# EAGLE design ButtonMatrix (EAGLE 6.5.0)
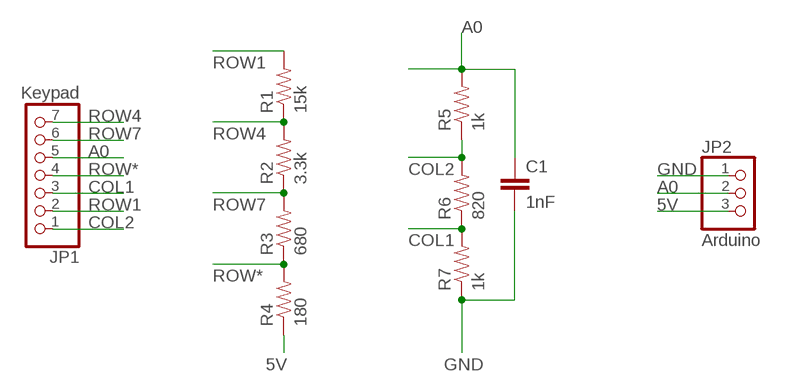
[diagram p0: schematic, sheet 1]

## Parts
C1  1nF  CAPPTH  [CAP-PTH-SMALL]
JP1  Keypad  PINHD-1X7  [1X07]
JP2  Arduino  PINHD-1X3  [1X03]
R1  15k  RESISTORPTH-1/2W  [AXIAL-0.5]
R2  3.3k  RESISTORPTH-1/2W  [AXIAL-0.5]
R3  680  RESISTORPTH-1/2W  [AXIAL-0.5]
R4  180  RESISTORPTH-1/2W  [AXIAL-0.5]
R5  1k  RESISTORPTH-1/2W  [AXIAL-0.5]
R6  820  RESISTORPTH-1/2W  [AXIAL-0.5]
R7  1k  RESISTORPTH-1/2W  [AXIAL-0.5]

## Nets
5V: JP2.3 R4.P$1
A0: C1.1 JP1.5 JP2.2 R5.P$2
COL1: JP1.3 R6.P$1 R7.P$2
COL2: JP1.1 R5.P$1 R6.P$2
GND: C1.2 JP2.1 R7.P$1
ROW1: JP1.2 R1.P$2
ROW4: JP1.7 R1.P$1 R2.P$2
ROW7: JP1.6 R2.P$1 R3.P$2
ROW*: JP1.4 R3.P$1 R4.P$2

## Library data of the parts
C1 = SparkFun-Capacitors:CAP: Capacitor Standard 0603 ceramic capacitor, and 0.1" leaded capacitor.
JP1 = pinhead:PINHD-1X7: PIN HEADER
JP2 = pinhead:PINHD-1X3: PIN HEADER
R1-R7 = SparkFun-Passives:RESISTOR: Resistor Basic schematic elements and footprints for 0603, 1206, and PTH resistors.

## Board
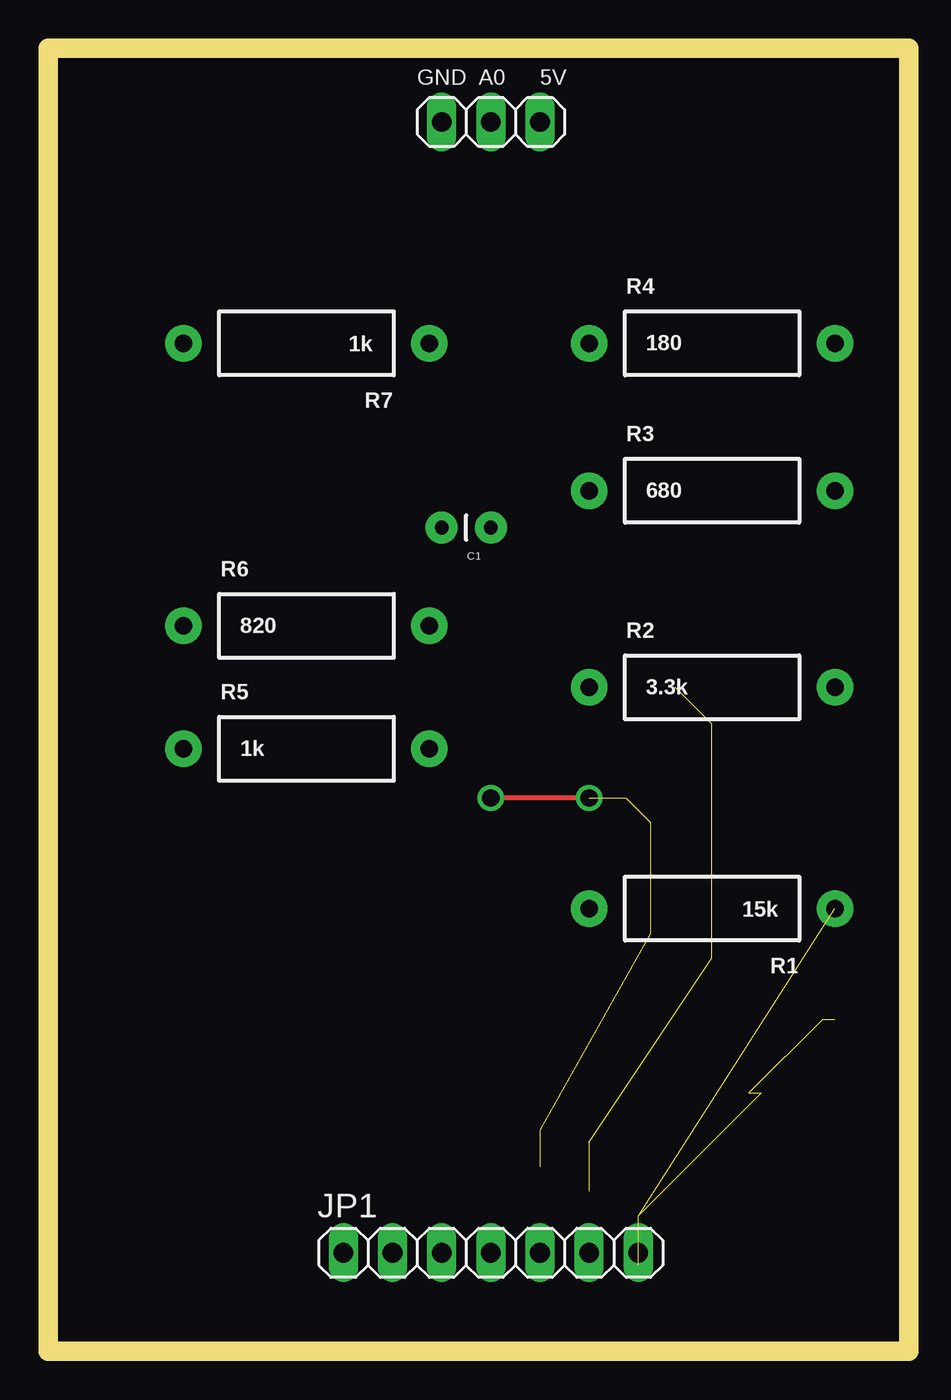
[diagram p1: board, top side]
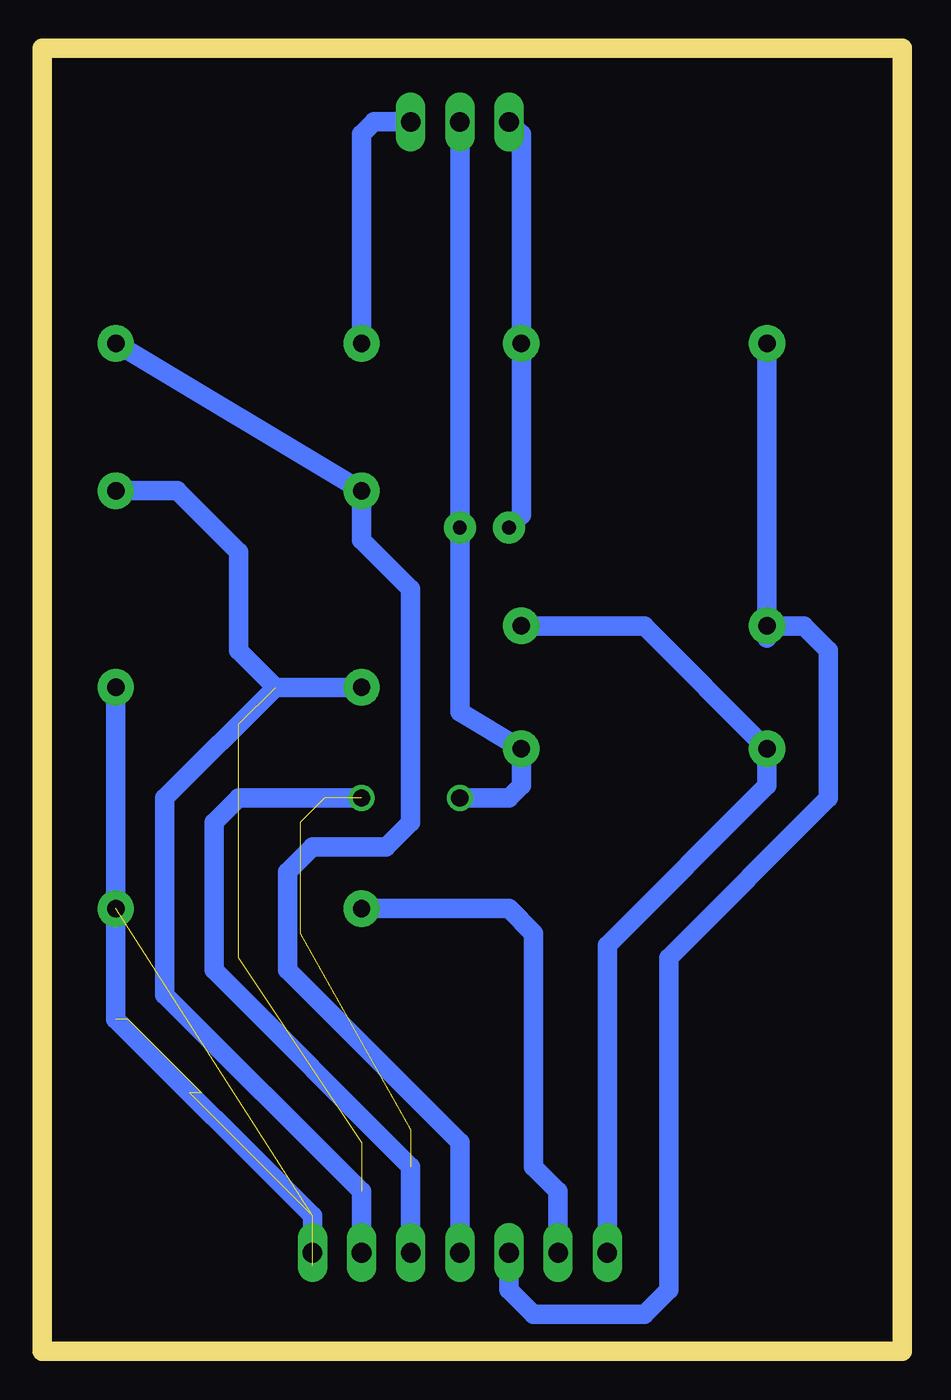
[diagram p2: board, bottom side, seen from below]

Size 44.12 x 67.3 mm. Coordinates in mm from the lower left corner, seen from the top.
Outline: 0,0 44.12,0 44.12,67.3 0,67.3 0,0
Copper layers (1*16): Top 0.035mm / dielectric 1.5mm / Bottom 0.035mm
Design rules "default": minimum track width 10mil, minimum drill 24mil, track to track 8mil, track to pad 8mil, pad to pad 8mil, via to via 8mil, smd to smd 8mil, copper to edge 40mil, drill to drill 8mil, minimum pad ring 10mil, minimum via ring 8mil, stop-mask expansion 4mil, vias tented up to drill 0mil, thermal gap 10mil
Milling: 4 lines

### Footprints (pad centres in the part's own frame; a part is rotated, then mirrored left to right if it is on the bottom)
CAP-PTH-SMALL = drill 0.7 pad 1.651: 1 0,0; 2 2.54,0
1X07 = drill 1.016 long: 1 -7.62,0; 2 -5.08,0; 3 -2.54,0; 4 0,0; 5 2.54,0; 6 5.08,0; 7 7.62,0
1X03 = drill 1.016 long: 1 -2.54,0; 2 0,0; 3 2.54,0
AXIAL-0.5 = drill 0.9 pad 1.88: P$1 -6.35,0; P$2 6.35,0

### Placement (x,y rotation side)
C1  22.86,42.55 180 top
JP1  22.86,5.08 0 top
JP2  22.86,63.5 0 top
R1  34.29,22.86 180 top
R2  34.29,34.29 0 top
R3  34.29,44.45 0 top
R4  34.29,52.07 0 top
R5  13.34,31.11 0 top
R6  13.34,37.47 0 top
R7  13.34,52.07 180 top

### Tracks (layer width: path | path; a pad name or v marks a point on that pad's centre or on a via)
5V
  Bottom 1.016: JP2.3 27.3,63.5 27.94,62.87 R4.P$1
A0  (via drill 0.9)  (5 unrouted)
  Top 0.254: v27.94,28.57 v22.86,28.57
  Bottom 1.016: JP2.2 C1.1 22.86,33.02 R5.P$2 19.68,29.21 20.32,28.57 v22.86,28.57 | JP1.5 25.4,9.53 35.56,19.68 35.56,27.3 34.29,28.57 v27.94,28.57
COL1
  Bottom 1.016: JP1.3 20.32,3.17 19.05,1.91 13.34,1.91 12.06,3.17 12.06,20.32 3.81,28.57 3.81,36.2 5.08,37.47 R6.P$1 | 6.99,36.83 R6.P$1 | R6.P$1 R7.P$2
COL2
  Bottom 1.016: JP1.1 15.24,8.26 15.24,8.89 15.24,20.95 6.99,29.21 R5.P$1 13.34,37.47 R6.P$2
GND
  Bottom 1.016: JP2.1 19.68,62.87 R7.P$1 19.68,43.18 C1.2
ROW1
  Bottom 1.016: R1.P$2 20.32,22.86 19.05,21.59 19.05,9.53 17.78,8.26 JP1.2
ROW4  (7 unrouted)
  Bottom 1.016: R2.P$2 R1.P$1 40.64,17.14 30.48,6.99 JP1.7
ROW7  (4 unrouted)
  Bottom 1.016: JP1.6 27.94,8.26 38.1,18.41 38.1,28.57 32.38,34.29 | 32.38,34.29 R2.P$1 | 32.38,34.29 34.29,36.2 34.29,41.27 37.47,44.45 R3.P$2
ROW*
  Bottom 1.016: JP1.4 22.86,10.79 31.75,19.68 31.75,24.77 30.48,26.04 26.67,26.04 25.4,27.3 25.4,39.37 27.94,41.91 R3.P$1 R4.P$2

### Text on the board
tNames: GND | A0 | 5V